# EasyEDA Pro project compute-module-v101.eprj, schematic main-board
Board Name: main-board; Create Date: 2025-09-19; Page Name: P1; Project Name: compute-module-v101; Schematic Name: main-board; Update Date: 2025-12-01; Company: EasyEDA.com; Page Size: A4; Version: V1.0
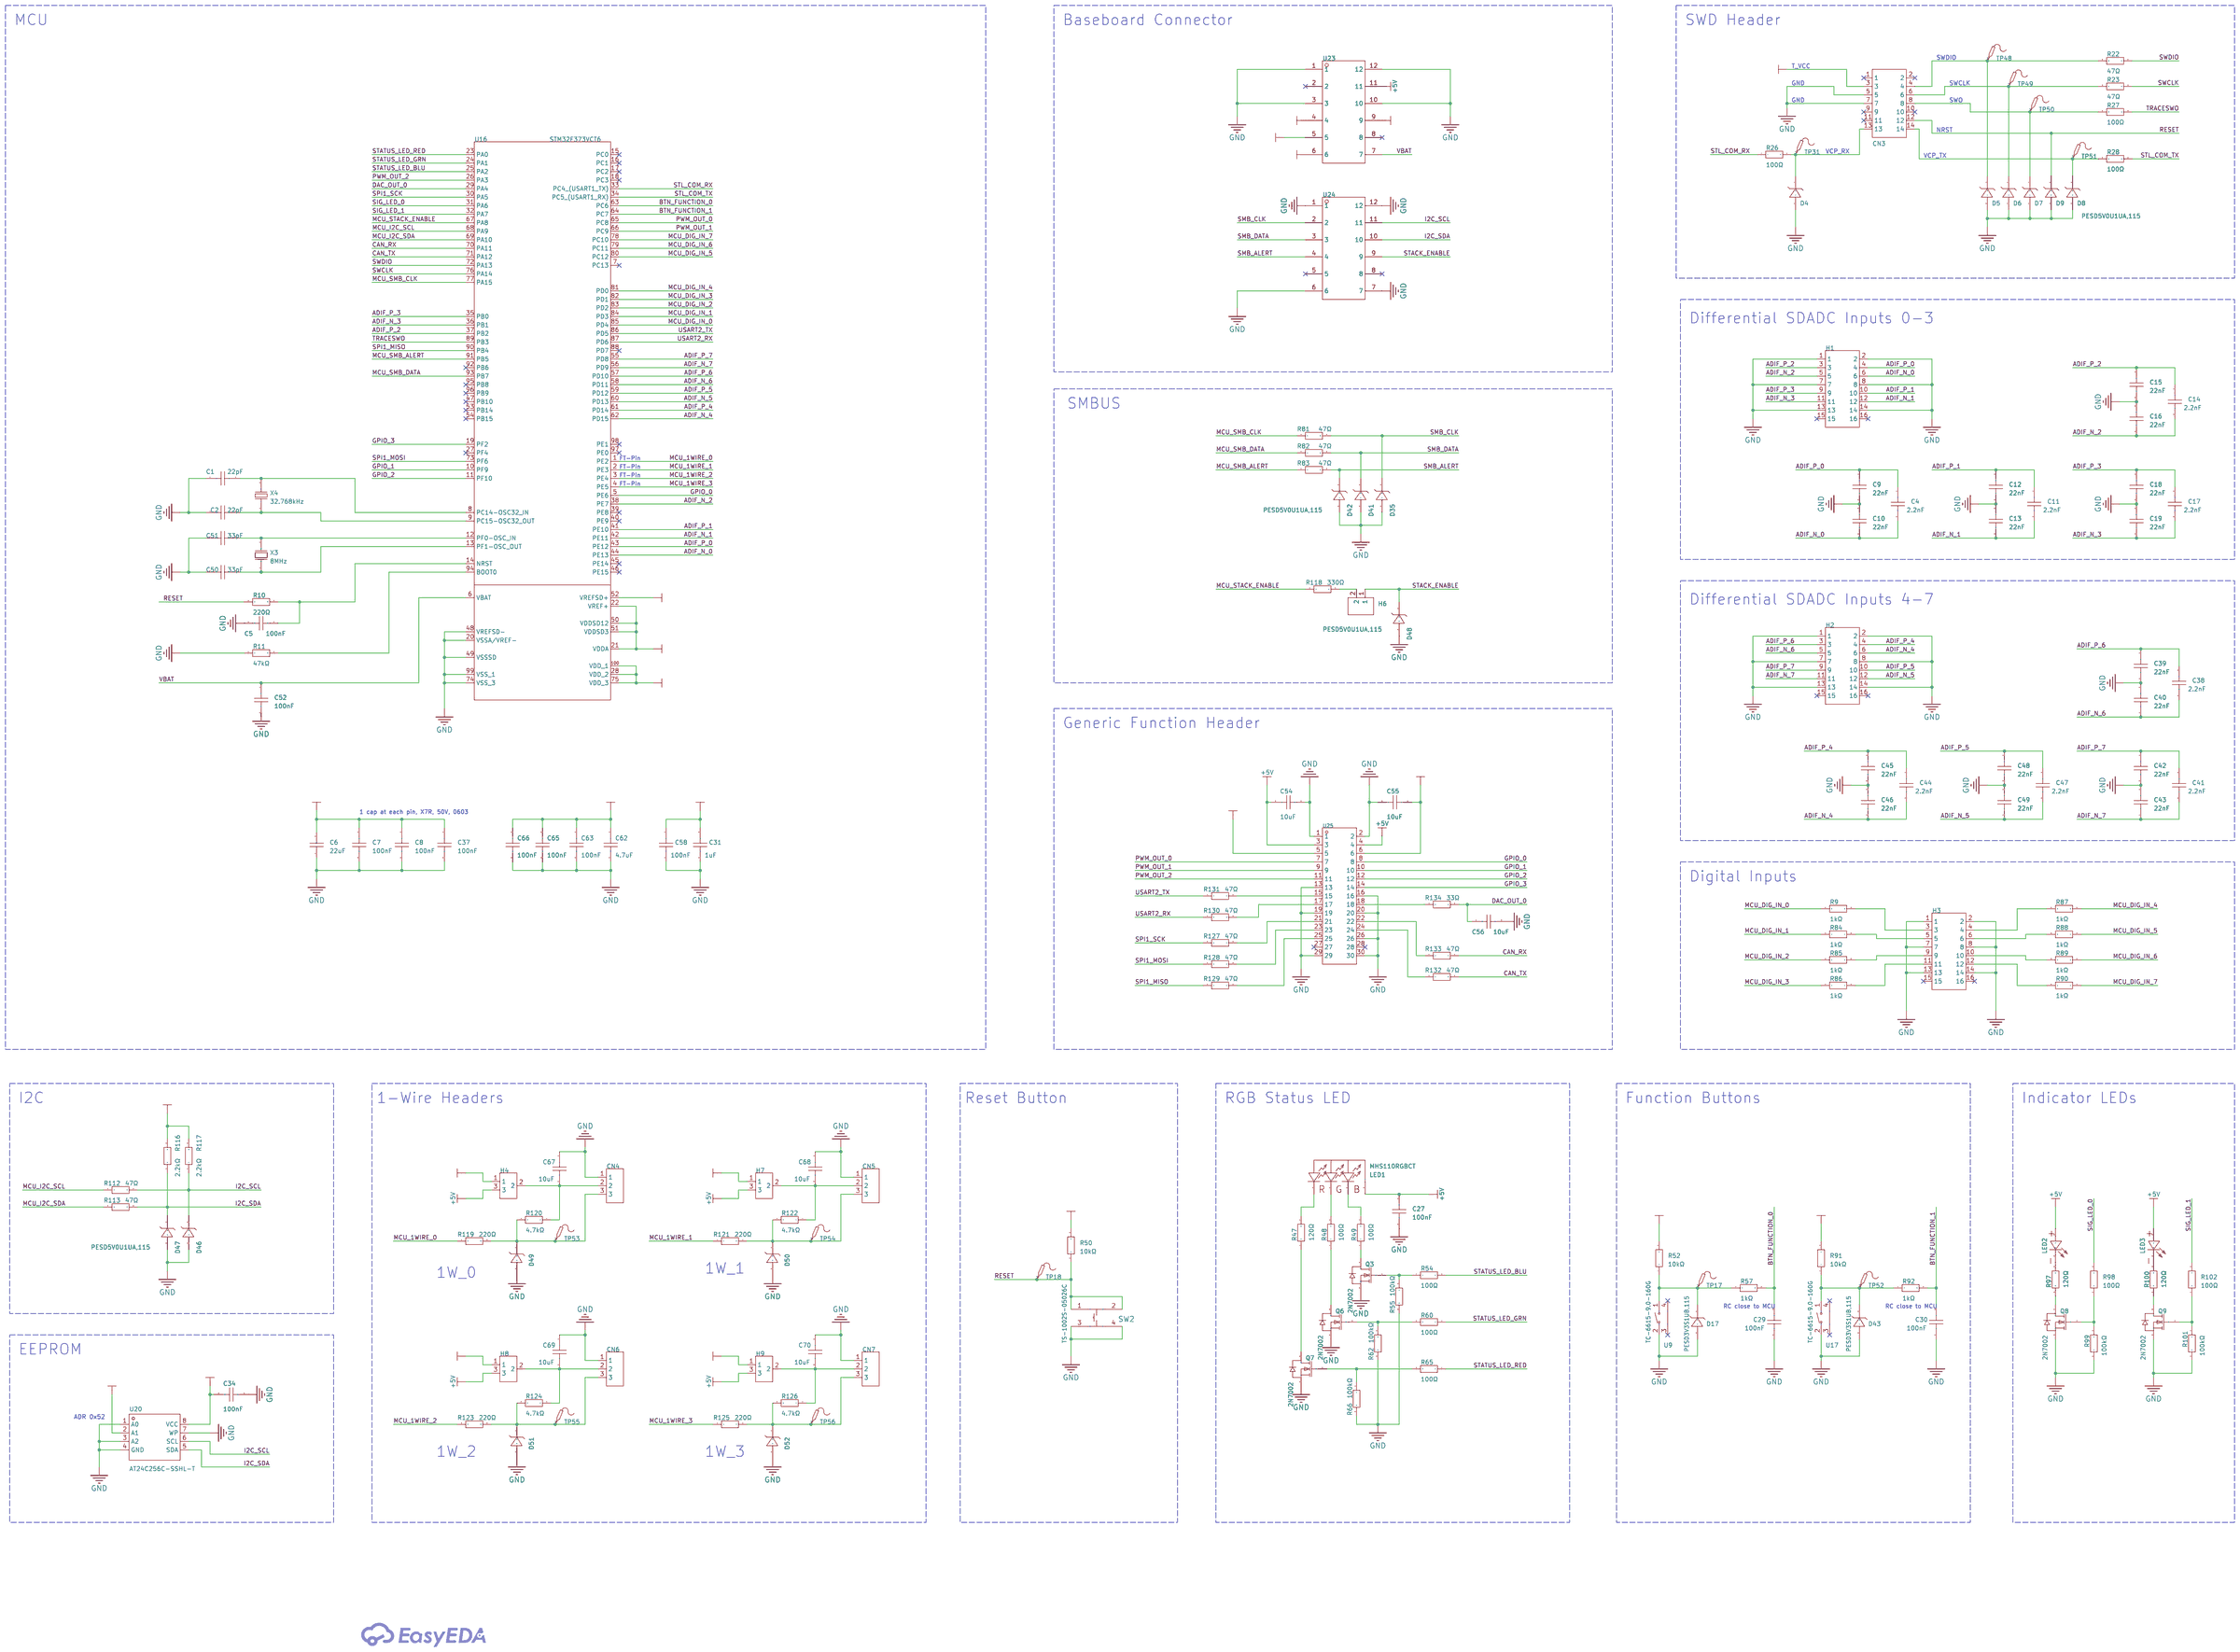
[diagram p1: schematic sheet]

## Parts
C1  22pF  [C0603]
C2  22pF  [C0603]
C4  2.2nF  [C0603]
C5  100nF  [C0603]
C6  22uF  [C0603]
C7  100nF  [C0603]
C8  100nF  [C0603]
C9  22nF  [C0603]
C10  22nF  [C0603]
C11  2.2nF  [C0603]
C12  22nF  [C0603]
C13  22nF  [C0603]
C14  2.2nF  [C0603]
C15  22nF  [C0603]
C16  22nF  [C0603]
C17  2.2nF  [C0603]
C18  22nF  [C0603]
C19  22nF  [C0603]
C27  100nF  [C0603]
C29  100nF  [C0603]
C30  100nF  [C0603]
C31  1uF  [C0603]
C34  100nF  [C0603]
C37  100nF  [C0603]
C38  2.2nF  [C0603]
C39  22nF  [C0603]
C40  22nF  [C0603]
C41  2.2nF  [C0603]
C42  22nF  [C0603]
C43  22nF  [C0603]
C44  2.2nF  [C0603]
C45  22nF  [C0603]
C46  22nF  [C0603]
C47  2.2nF  [C0603]
C48  22nF  [C0603]
C49  22nF  [C0603]
C50  33pF  [C0603]
C51  33pF  [C0603]
C52  100nF  [C0603]
C54  10uF  [C0603]
C55  10uF  [C0603]
C56  10uF  [C0603]
C58  100nF  [C0603]
C62  4.7uF  [C0603]
C63  100nF  [C0603]
C65  100nF  [C0603]
C66  100nF  [C0603]
C67  10uF  [C0603]
C68  10uF  [C0603]
C69  10uF  [C0603]
C70  10uF  [C0603]
CN3  HX PZ1.27-2x7P WZ  [HDR-TH_14P-P1.27-H-M-R2-C7-S1.27-W7.5-N]
CN4  B3B-PH-K-S(LF)(SN)  [CONN-TH_B3B-PH-K-S]
CN5  B3B-PH-K-S(LF)(SN)  [CONN-TH_B3B-PH-K-S]
CN6  B3B-PH-K-S(LF)(SN)  [CONN-TH_B3B-PH-K-S]
CN7  B3B-PH-K-S(LF)(SN)  [CONN-TH_B3B-PH-K-S]
D4  PESD5V0U1UA,115  [SOD-323_L1.8-W1.3-LS2.5-RD]
D5  PESD5V0U1UA,115  [SOD-323_L1.8-W1.3-LS2.5-RD]
D6  PESD5V0U1UA,115  [SOD-323_L1.8-W1.3-LS2.5-RD]
D7  PESD5V0U1UA,115  [SOD-323_L1.8-W1.3-LS2.5-RD]
D8  PESD5V0U1UA,115  [SOD-323_L1.8-W1.3-LS2.5-RD]
D9  PESD5V0U1UA,115  [SOD-323_L1.8-W1.3-LS2.5-RD]
D17  PESD3V3S1UB,115  [SOD-523_L1.2-W0.8-LS1.6-RD]
D35  PESD5V0U1UA,115  [SOD-323_L1.8-W1.3-LS2.5-RD]
D41  PESD5V0U1UA,115  [SOD-323_L1.8-W1.3-LS2.5-RD]
D42  PESD5V0U1UA,115  [SOD-323_L1.8-W1.3-LS2.5-RD]
D43  PESD3V3S1UB,115  [SOD-523_L1.2-W0.8-LS1.6-RD]
D46  PESD5V0U1UA,115  [SOD-323_L1.8-W1.3-LS2.5-RD]
D47  PESD5V0U1UA,115  [SOD-323_L1.8-W1.3-LS2.5-RD]
D48  PESD5V0U1UA,115  [SOD-323_L1.8-W1.3-LS2.5-RD]
D49  PESD5V0U1UA,115  [SOD-323_L1.8-W1.3-LS2.5-RD]
D50  PESD5V0U1UA,115  [SOD-323_L1.8-W1.3-LS2.5-RD]
D51  PESD5V0U1UA,115  [SOD-323_L1.8-W1.3-LS2.5-RD]
D52  PESD5V0U1UA,115  [SOD-323_L1.8-W1.3-LS2.5-RD]
H1  XDZ200-2-08-S-2.0-G1  [HDR-SMD_16P-P2.00-V-M-R2-C8-LS6.5]
H2  XDZ200-2-08-S-2.0-G1  [HDR-SMD_16P-P2.00-V-M-R2-C8-LS6.5]
H3  XDZ200-2-08-S-2.0-G1  [HDR-SMD_16P-P2.00-V-M-R2-C8-LS6.5]
H4  X6511WVS-03H-C60D48R2  [HDR-SMD_3P-P2.54_XKB_X6511WVS-03H-C60D48R2]
H6  PZ254V-11-02P  [HDR-TH_2P-P2.54-V-M]
H7  X6511WVS-03H-C60D48R2  [HDR-SMD_3P-P2.54_XKB_X6511WVS-03H-C60D48R2]
H8  X6511WVS-03H-C60D48R2  [HDR-SMD_3P-P2.54_XKB_X6511WVS-03H-C60D48R2]
H9  X6511WVS-03H-C60D48R2  [HDR-SMD_3P-P2.54_XKB_X6511WVS-03H-C60D48R2]
LED1  MHS110RGBCT  [LED-ARRAY-SMD_MHS110RGBCT]
LED2  LTST-S220TGKT  [LED-SMD_L2.2-W0.6-RD_GREEN]
LED3  LTST-S220TGKT  [LED-SMD_L2.2-W0.6-RD_GREEN]
Q3  2N7002  [SOT-23-3_L2.9-W1.3-P1.90-LS2.4-BR]
Q6  2N7002  [SOT-23-3_L2.9-W1.3-P1.90-LS2.4-BR]
Q7  2N7002  [SOT-23-3_L2.9-W1.3-P1.90-LS2.4-BR]
Q8  2N7002  [SOT-23-3_L2.9-W1.3-P1.90-LS2.4-BR]
Q9  2N7002  [SOT-23-3_L2.9-W1.3-P1.90-LS2.4-BR]
R9  1kΩ  [R0603]
R10  220Ω  [R0603]
R11  47kΩ  [R0603]
R22  47Ω  [R0603]
R23  47Ω  [R0603]
R26  100Ω  [R0603]
R27  100Ω  [R0603]
R28  100Ω  [R0603]
R47  120Ω  [R0603]
R48  100Ω  [R0603]
R49  100Ω  [R0603]
R50  10kΩ  [R0603]
R52  10kΩ  [R0603]
R54  100Ω  [R0603]
R55  100kΩ  [R0603]
R57  1kΩ  [R0603]
R60  100Ω  [R0603]
R62  100kΩ  [R0603]
R65  100Ω  [R0603]
R66  100kΩ  [R0603]
R81  47Ω  [R0603]
R82  47Ω  [R0603]
R83  47Ω  [R0603]
R84  1kΩ  [R0603]
R85  1kΩ  [R0603]
R86  1kΩ  [R0603]
R87  1kΩ  [R0603]
R88  1kΩ  [R0603]
R89  1kΩ  [R0603]
R90  1kΩ  [R0603]
R91  10kΩ  [R0603]
R92  1kΩ  [R0603]
R97  120Ω  [R0603]
R98  100Ω  [R0603]
R99  100kΩ  [R0603]
R100  120Ω  [R0603]
R101  100kΩ  [R0603]
R102  100Ω  [R0603]
R112  47Ω  [R0603]
R113  47Ω  [R0603]
R116  2.2kΩ  [R0603]
R117  2.2kΩ  [R0603]
R118  330Ω  [R0603]
R119  220Ω  [R0603]
R120  4.7kΩ  [R0603]
R121  220Ω  [R0603]
R122  4.7kΩ  [R0603]
R123  220Ω  [R0603]
R124  4.7kΩ  [R0603]
R125  220Ω  [R0603]
R126  4.7kΩ  [R0603]
R127  47Ω  [R0603]
R128  47Ω  [R0603]
R129  47Ω  [R0603]
R130  47Ω  [R0603]
R131  47Ω  [R0603]
R132  47Ω  [R0603]
R133  47Ω  [R0603]
R134  33Ω  [R0603]
SW2  TS-1002S-05026C  [KEY-SMD_4P-L6.0-W6.0-P4.50-LS9.0]
TP17  -  [Test-Point-0.5mm]
TP18  -  [Test-Point-0.5mm]
TP31  -  [Test-Point-0.5mm]
TP48  -  [Test-Point-0.5mm]
TP49  -  [Test-Point-0.5mm]
TP50  -  [Test-Point-0.5mm]
TP51  -  [Test-Point-0.5mm]
TP52  -  [Test-Point-0.5mm]
TP53  -  [Test-Point-0.5mm]
TP54  -  [Test-Point-0.5mm]
TP55  -  [Test-Point-0.5mm]
TP56  -  [Test-Point-0.5mm]
U9  TC-6615-9.0-160G  [KEY-TH_PTS645VXX83XLFS]
U16  STM32F373VCT6  [LQFP-100_L14.0-W14.0-P0.50-LS16.0-BL]
U17  TC-6615-9.0-160G  [KEY-TH_PTS645VXX83XLFS]
U20  AT24C256C-SSHL-T  [SOIC-8_L4.9-W3.9-P1.27-LS6.0-BL]
U23  -  [ED12BGFBK-CARD]  (no BOM)
U24  -  [ED12BGFBK-CARD]  (no BOM)
U25  XDZ200-2-15-S-2.0-G1  [HDR-SMD_30P-P2.00-V-M-R2-C15-LS6.5]
X3  8MHz  [CRYSTAL-SMD_L5.0-W3.2]
X4  32.768kHz  [FC-135R_L3.2-W1.5]

## Library data of the parts
C1 C2 = CL10C220JB8NNNC: Capacitance:22pF Tolerance:±5% Tolerance:±5% Voltage Rating:50V Temperature Coefficient:C0G; LCSC Part Name: 22pF ±5% 50V; Supplier Part: C1653; Manufacturer: SAMSUNG(三星); Supplier Footprint: 0603; JLCPCB Part Class: Basic Part; Datasheet: https://item.szlcsc.com/datasheet/CL10C220JB8NNNC/2005.html; Supplier: LCSC; Tolerance: ±5%; Voltage Rating: 50V; Temperature Coefficient: C0G
C4 C11 C14 C17 C38 C41 C44 C47 = 0603B222K500NT: Capacitance:2.2nF Tolerance:±10% Tolerance:±10% Voltage Rating:50V Temperature Coefficient:X7R; LCSC Part Name: 2.2nF ±10% 50V; Supplier Part: C1604; Manufacturer: FH(风华); Supplier Footprint: 0603; JLCPCB Part Class: Basic Part; Datasheet: https://item.szlcsc.com/datasheet/0603B222K500NT/1956.html; Supplier: LCSC; Tolerance: ±10%; Voltage Rating: 50V; Temperature Coefficient: X7R
C5 C7 C8 C27 C29 C30 C34 C37 C52 C58 C63 C65 C66 = CC0603KRX7R9BB104: Capacitance:100nF Tolerance:±10% Tolerance:±10% Voltage Rating:50V Temperature Coefficient:X7R; LCSC Part Name: 100nF ±10% 50V; Supplier Part: C14663; Manufacturer: YAGEO(国巨); Supplier Footprint: 0603; JLCPCB Part Class: Basic Part; Datasheet: https://item.szlcsc.com/datasheet/CC0603KRX7R9BB104/15331.html; Supplier: LCSC; Tolerance: ±10%; Voltage Rating: 50V; Temperature Coefficient: X7R
C6 = CL10A226MQ8NRNC: Capacitance:22uF Tolerance:±20% Tolerance:±20% Voltage Rating:6.3V Temperature Coefficient:X5R; LCSC Part Name: 22uF ±20% 6.3V; Supplier Part: C59461; Manufacturer: SAMSUNG(三星); Supplier Footprint: 0603; JLCPCB Part Class: Basic Part; Datasheet: https://item.szlcsc.com/datasheet/CL10A226MQ8NRNC/60514.html; Supplier: LCSC; Tolerance: ±20%; Voltage Rating: 6.3V; Temperature Coefficient: X5R
C9 C10 C12 C13 C15 C16 C18 C19 C39 C40 C42 C43 C45 C46 C48 C49 = CL10B223KB8NNNC: Capacitance:22nF Tolerance:±10% Tolerance:±10% Voltage Rating:50V Temperature Coefficient:X7R; LCSC Part Name: 22nF ±10% 50V; Supplier Part: C21122; Manufacturer: SAMSUNG(三星); Supplier Footprint: 0603; JLCPCB Part Class: Basic Part; Datasheet: https://item.szlcsc.com/datasheet/CL10B223KB8NNNC/21834.html; Supplier: LCSC; Tolerance: ±10%; Voltage Rating: 50V; Temperature Coefficient: X7R
C31 = CL10A105KB8NNNC: Capacitance:1uF Tolerance:±10% Tolerance:±10% Voltage Rating:50V Temperature Coefficient:X5R; LCSC Part Name: 1uF ±10% 50V; Supplier Part: C15849; Manufacturer: SAMSUNG(三星); Supplier Footprint: 0603; JLCPCB Part Class: Basic Part; Datasheet: https://item.szlcsc.com/datasheet/CL10A105KB8NNNC/16531.html; Supplier: LCSC; Tolerance: ±10%; Voltage Rating: 50V; Temperature Coefficient: X5R
C50 C51 = CL10C330JB8NNNC: Capacitance:33pF Tolerance:±5% Tolerance:±5% Voltage Rating:50V Temperature Coefficient:C0G; LCSC Part Name: 33pF ±5% 50V; Supplier Part: C1663; Manufacturer: SAMSUNG(三星); Supplier Footprint: 0603; JLCPCB Part Class: Basic Part; Datasheet: https://item.szlcsc.com/datasheet/CL10C330JB8NNNC/2015.html; Supplier: LCSC; Tolerance: ±5%; Voltage Rating: 50V; Temperature Coefficient: C0G
C54-C56 C67-C70 = CL10A106MA8NRNC: Capacitance:10uF Tolerance:±20% Tolerance:±20% Voltage Rating:25V Temperature Coefficient:X5R; LCSC Part Name: 10uF ±20% 25V; Supplier Part: C96446; Manufacturer: SAMSUNG(三星); Supplier Footprint: 0603; JLCPCB Part Class: Basic Part; Datasheet: https://item.szlcsc.com/datasheet/CL10A106MA8NRNC/97651.html; Supplier: LCSC; Tolerance: ±20%; Voltage Rating: 25V; Temperature Coefficient: X5R
C62 = CL10A475KO8NNNC: Capacitance:4.7uF Tolerance:±10% Tolerance:±10% Voltage Rating:16V Temperature Coefficient:X5R; LCSC Part Name: 4.7uF ±10% 16V; Supplier Part: C19666; Manufacturer: SAMSUNG(三星); Supplier Footprint: 0603; JLCPCB Part Class: Basic Part; Datasheet: https://item.szlcsc.com/datasheet/CL10A475KO8NNNC/20375.html; Supplier: LCSC; Tolerance: ±10%; Voltage Rating: 16V; Temperature Coefficient: X5R
CN3 = HX PZ1.27-2x7P WZ: Pin Structure:2x7P Pitch:1.27mm Row Spacing:1.27mm Circluar Pins/Square Pins:Pin Header Mounting Type:Right Angle Number of Rows:2 Number of Pins:14P Current Rating:1A Voltage Rating (Max):500V Length of Mating Pin:4mm Insulation Height:1mm Length of End; LCSC Part Name: 2x7P 间距:1.27mm 方针 弯插; Supplier Part: C22438113; Manufacturer: hanxia(韩下); Supplier Footprint: 弯插,P=1.27mm; JLCPCB Part Class: Extended Part; Datasheet: https://item.szlcsc.com/datasheet/HX%2520PZ1.27-2x7P%2520WZ/24075358.html; Supplier: LCSC; Pin Structure: 2x7P; Pitch: 1.27mm; Row Spacing: 1.27mm; Circluar Pins/Square Pins: Pin Header; Mounting Type: Right Angle; Number of Rows: 2; Number of Pins: 14P; Current Rating: 1A; Voltage Rating (Max): 500V; Length of Mating Pin: 4mm; Insulation Height: 1mm; Contact Material: Brass; Contact Plating: Gold; Operating Temperature: -40℃~+105℃; Color: Black
CN4-CN7 = B3B-PH-K-S(LF)(SN): LCSC Part Name: 1x3P 间距:2mm 直插 系列:PH; Supplier Part: C131339; Manufacturer: JST; Supplier Footprint: 插件,P=2mm; JLCPCB Part Class: Extended Part; Datasheet: https://item.szlcsc.com/datasheet/B3B-PH-K-S(LF)(SN)/142632.html; Supplier: LCSC; Pins Structure: 1x3P; Pitch: 2mm; Mounting Type: Through Hole; Reference Series: PH; Number of Pins: 3P; Number of Rows: 1; Number of PINs Per Row: 3; Current Rating: 2A; Contact Material: Brass; Contact Plating: Tin; Operating Temperature: -25℃~+85℃; Voltage Rating: 100V; Plastic Material: PA66; Flame Retardant Rating: UL94V-0; Supplementary Features: K Pin; Color: White; Z-Height of the Board: 6mm; X-Length of Bottom Edge on Board (Spacing Line): 7.9mm; Y-Width of Bottom Edge on Board: 4.5mm
D4-D9 D35 D41 D42 D46-D52 = PESD5V0U1UA,115: LCSC Part Name: 单向ESD; Supplier Part: C139614; Manufacturer: Nexperia(安世); Supplier Footprint: SOD-323; JLCPCB Part Class: Extended Part; Datasheet: https://item.szlcsc.com/datasheet/PESD5V0U1UA%252C115/150939.html; Supplier: LCSC; Polarity: Unidirectional; Reverse Stand-Off Voltage (Vrwm): 5V; Clamping Voltage: 11V; Peak Pulse Current (Ipp): 1.3A@8/20us; Voltage - Breakdown: 8.8V; Reverse Leakage Current (Ir): 1nA; Number of Channels: 1; Operating Temperature: -55℃~+150℃@(Ta); level of protection: IEC 61000-4-2; Type: ESD; Junction Capacitance: 2pF
D17 D43 = PESD3V3S1UB,115: LCSC Part Name: 单向ESD; Supplier Part: C85377; Manufacturer: Nexperia(安世); Supplier Footprint: SC-79(SOD-523); JLCPCB Part Class: Extended Part; Datasheet: https://item.szlcsc.com/datasheet/PESD3V3S1UB%252C115/86550.html; Supplier: LCSC; Polarity: Unidirectional; Reverse Stand-Off Voltage (Vrwm): 3.3V; Clamping Voltage: 20V; Peak Pulse Current (Ipp): 18A; Peak Pulse Power Dissipation (Ppp): 330W; Voltage - Breakdown: 5.2V; Number of Channels: 1; Operating Temperature: -65℃~+150℃@(Ta); Type: ESD
H1-H3 = XDZ200-2-08-S-2.0-G1: LCSC Part Name: 2x8P 间距:2mm 方针 立贴; Supplier Part: C19268811; Manufacturer: XUNDA(讯答); Supplier Footprint: SMD,P=2mm; JLCPCB Part Class: Extended Part; Datasheet: https://item.szlcsc.com/datasheet/XDZ200-2-08-S-2.0-G1/20528703.html; Supplier: LCSC; Pin Structure: 2x8P; Pitch: 2mm; Circluar Pins/Square Pins: Pin Header; Mounting Type: Surface Mount,Vertical; Number of Rows: 2; Number of Pins: 16P; Current Rating: 1.5A; Length of Mating Pin: 4mm; Insulation Height: 2mm; Operating Temperature: -40℃~+105℃; Color: Black
H4 H7-H9 = X6511WVS-03H-C60D48R2: Pin Structure:1x3P Pitch:2.54mm Row Spacing:2.54mm Circluar Pins/Square Pins:Policy Number of Rows:Single Row Number of Pins:3P Current Rating:3A Voltage Rating (Max):250V Length of Mating Pin:- Insulation Height:2.5mm Length of End Connection Pin:- Conta; LCSC Part Name: 1x3P 间距:2.54mm 方针; Supplier Part: C2883760; Manufacturer: XKB Connection(中国星坤); Supplier Footprint: SMD,P=2.54mm; JLCPCB Part Class: Extended Part; Datasheet: https://atta.szlcsc.com/upload/public/pdf/source/20200909/C780060_F941EB1B69F43B5D6329EAF74E2E27BB.pdf; Supplier: LCSC; Pin Structure: 1x3P; Pitch: 2.54mm; Row Spacing: 2.54mm; Circluar Pins/Square Pins: Policy; Number of Rows: Single Row; Number of Pins: 3P; Current Rating: 3A; Voltage Rating (Max): 250V; Insulation Height: 2.5mm; Contact Material: Brass; Contact Plating: Gold; Operating Temperature: -40℃~+105℃; Color: Black
H6 = PZ254V-11-02P: LCSC Part Name: 1x2P 间距:2.54mm 方针 直插; Supplier Part: C492401; Manufacturer: XFCN(兴飞); Supplier Footprint: 插件,P=2.54mm; JLCPCB Part Class: Extended Part; Datasheet: https://item.szlcsc.com/datasheet/PZ254V-11-02P/502957.html; Supplier: LCSC; Pin Structure: 1x2P; Pitch: 2.54mm; Circluar Pins/Square Pins: Pin Header; Mounting Type: Through Hole; Number of Rows: 1; Number of Pins: 2P; Length of Mating Pin: 6mm; Insulation Height: 2.5mm; Length of End Connection Pin: 3mm; Contact Material: Brass; Operating Temperature: -40℃~+105℃; Color: Black
LED1 = MHS110RGBCT: LCSC Part Name: RGB三色 侧贴; Supplier Part: C389528; Manufacturer: MEIHUA(美华); Supplier Footprint: SMD,1.5x3mm; JLCPCB Part Class: Extended Part; Datasheet: https://atta.szlcsc.com/upload/public/pdf/source/20190530/C389528_18CC971B89683121AF99AD38EE2CA1FC.pdf; Supplier: LCSC
LED2 LED3 = LTST-S220TGKT: Illumination Color:Yellow Green Voltage - Forward(Vf):3.2V Voltage - Forward(Vf):3.2V Power(Watts):76mW Forward Current:20mA Wavelength - Dominant:525nm Wavelength - Dominant:525nm Peak Wavelength:530nm Diode Configuration:- Lens Color:Water Clear Color T; LCSC Part Name: 普绿/黄绿 侧贴; Supplier Part: C160470; Manufacturer: LITEON(光宝); Supplier Footprint: SMD,1x2.2mm; JLCPCB Part Class: Extended Part; Datasheet: https://item.szlcsc.com/datasheet/LTST-S220TGKT/171850.html; Supplier: LCSC; Illumination Color: Yellow Green; Voltage - Forward(Vf): 3.2V; Power(Watts): 76mW; Forward Current: 20mA; Wavelength - Dominant: 525nm; Peak Wavelength: 530nm; Lens Color: Water Clear; Luminous Intensity: 260.5mcd; Viewing Angle: 130°; Mounting Style: Side View Mount; Operating Temperature: -20℃~+80℃
Q3 Q6-Q9 = 2N7002_C8545: LCSC Part Name: 1个N沟道 耐压:60V 电流:115mA; Supplier Part: C8545; Manufacturer: CJ(江苏长电/长晶); Supplier Footprint: SOT-23; JLCPCB Part Class: Basic Part; Datasheet: https://item.szlcsc.com/datasheet/2N7002/9040.html; Supplier: LCSC; Number: 1 N-Channel; Drain to Source Voltage: 60V; Current - Continuous Drain(Id): 115mA; RDS(on): 5Ω@10V; Pd - Power Dissipation: 225mW; Gate Threshold Voltage (Vgs(th)): 2.5V; Input Capacitance(Ciss): 50pF; Reverse Transfer Capacitance (Crss@Vds): 5pF
R9 R57 R84-R90 R92 = 0603WAF1001T5E: Type:Thick Film Resistors Resistance:1kΩ Tolerance:±1% Tolerance:±1% Power(Watts): Overload Voltage (Max): Temperature Coefficient:±100ppm/℃ Temperature Coefficient:±100ppm/℃ Operating Temperature Range:-55℃~+155℃ Operating Temperature Range:-55℃~+155℃; LCSC Part Name: 1kΩ ±1% 100mW 厚膜电阻; Supplier Part: C21190; Manufacturer: UNI-ROYAL(厚声); Supplier Footprint: 0603; JLCPCB Part Class: Basic Part; Datasheet: https://atta.szlcsc.com/upload/public/pdf/source/20200306/C422600_1E6D84923E4A46A82E41ADD87F860B5C.pdf; Supplier: LCSC; Type: Thick Film Resistors; Tolerance: ±1%; Temperature Coefficient: ±100ppm/℃; Operating Temperature Range: -55℃~+155℃
R10 R119 R121 R123 R125 = 0603WAF2200T5E: Type:Thick Film Resistors Resistance: Tolerance:±1% Tolerance:±1% Power(Watts): Overload Voltage (Max): Temperature Coefficient:±100ppm/℃ Temperature Coefficient:±100ppm/℃ Operating Temperature Range:-55℃~+155℃ Operating Temperature Range:-55℃~+155℃; LCSC Part Name: 220Ω ±1% 100mW 厚膜电阻; Supplier Part: C22962; Manufacturer: UNI-ROYAL(厚声); Supplier Footprint: 0603; JLCPCB Part Class: Basic Part; Datasheet: https://atta.szlcsc.com/upload/public/pdf/source/20200306/C422600_1E6D84923E4A46A82E41ADD87F860B5C.pdf; Supplier: LCSC; Type: Thick Film Resistors; Tolerance: ±1%; Temperature Coefficient: ±100ppm/℃; Operating Temperature Range: -55℃~+155℃
R11 = 0603WAF4702T5E: Type:Thick Film Resistor Resistance:47kΩ Tolerance:±1% Tolerance:±1% Power(Watts):100mW Voltage-Supply(Max):75V Temperature Coefficient:±100ppm/℃ Temperature Coefficient:±100ppm/℃ Operating Temperature:-55℃~+155℃ Operating Temperature:-55℃~+155℃; LCSC Part Name: 47kΩ ±1% 100mW 厚膜电阻; Supplier Part: C25819; Manufacturer: UNI-ROYAL(厚声); Supplier Footprint: 0603; JLCPCB Part Class: Basic Part; Datasheet: https://item.szlcsc.com/datasheet/0603WAF4702T5E/26562.html; Supplier: LCSC; Type: Thick Film Resistor; Tolerance: ±1%; Power(Watts): 100mW; Voltage-Supply(Max): 75V; Temperature Coefficient: ±100ppm/℃; Operating Temperature: -55℃~+155℃
R22 R23 R81-R83 R112 R113 R127-R133 = 0603WAF470JT5E: Type:Thick Film Resistor Resistance:47Ω Tolerance:±1% Tolerance:±1% Power(Watts):100mW Voltage-Supply(Max):75V Temperature Coefficient:±100ppm/℃ Temperature Coefficient:±100ppm/℃ Operating Temperature:-55℃~+155℃ Operating Temperature:-55℃~+155℃; LCSC Part Name: 47Ω ±1% 100mW 厚膜电阻; Supplier Part: C23182; Manufacturer: UNI-ROYAL(厚声); Supplier Footprint: 0603; JLCPCB Part Class: Basic Part; Datasheet: https://item.szlcsc.com/datasheet/0603WAF470JT5E/23909.html; Supplier: LCSC; Type: Thick Film Resistor; Tolerance: ±1%; Power(Watts): 100mW; Voltage-Supply(Max): 75V; Temperature Coefficient: ±100ppm/℃; Operating Temperature: -55℃~+155℃
R26-R28 R48 R49 R54 R60 R65 R98 R102 = 0603WAF1000T5E: Type:Thick Film Resistors Resistance: Tolerance:±1% Tolerance:±1% Power(Watts): Overload Voltage (Max): Temperature Coefficient:±200ppm/℃ Temperature Coefficient:±200ppm/℃ Operating Temperature Range:-55℃~+155℃ Operating Temperature Range:-55℃~+155℃; LCSC Part Name: 100Ω ±1% 100mW 厚膜电阻; Supplier Part: C22775; Manufacturer: UNI-ROYAL(厚声); Supplier Footprint: 0603; JLCPCB Part Class: Basic Part; Datasheet: https://atta.szlcsc.com/upload/public/pdf/source/20200306/C422600_1E6D84923E4A46A82E41ADD87F860B5C.pdf; Supplier: LCSC; Type: Thick Film Resistors; Tolerance: ±1%; Temperature Coefficient: ±200ppm/℃; Operating Temperature Range: -55℃~+155℃
R47 = 0603WAF1200T5E: Type:Thick Film Resistors Resistance: Tolerance:±1% Tolerance:±1% Power(Watts): Overload Voltage (Max): Temperature Coefficient:±100ppm/℃ Temperature Coefficient:±100ppm/℃ Operating Temperature Range:-55℃~+155℃ Operating Temperature Range:-55℃~+155℃; LCSC Part Name: 120Ω ±1% 100mW 厚膜电阻; Supplier Part: C22787; Manufacturer: UNI-ROYAL(厚声); Supplier Footprint: 0603; JLCPCB Part Class: Basic Part; Datasheet: https://atta.szlcsc.com/upload/public/pdf/source/20200306/C422600_1E6D84923E4A46A82E41ADD87F860B5C.pdf; Supplier: LCSC; Type: Thick Film Resistors; Tolerance: ±1%; Temperature Coefficient: ±100ppm/℃; Operating Temperature Range: -55℃~+155℃
R50 R52 R91 = 0603WAF1002T5E: Type:Thick Film Resistor Resistance:10kΩ Tolerance:±1% Tolerance:±1% Power(Watts):100mW Voltage-Supply(Max):75V Temperature Coefficient:±100ppm/℃ Temperature Coefficient:±100ppm/℃ Operating Temperature:-55℃~+155℃ Operating Temperature:-55℃~+155℃; LCSC Part Name: 厚膜电阻 10kΩ ±1% 100mW; Supplier Part: C25804; Manufacturer: UNI-ROYAL(厚声); Supplier Footprint: 0603; JLCPCB Part Class: Basic Part; Datasheet: https://item.szlcsc.com/datasheet/0603WAF1002T5E/26547.html; Supplier: LCSC; Type: Thick Film Resistor; Tolerance: ±1%; Power(Watts): 100mW; Voltage-Supply(Max): 75V; Temperature Coefficient: ±100ppm/℃; Operating Temperature: -55℃~+155℃
R55 R62 R66 R99 R101 = 0603WAF1003T5E: Type:Thick Film Resistor Resistance:100kΩ Tolerance:±1% Tolerance:±1% Power(Watts):100mW Voltage-Supply(Max):75V Temperature Coefficient:±100ppm/℃ Temperature Coefficient:±100ppm/℃ Operating Temperature:-55℃~+155℃ Operating Temperature:-55℃~+155℃; LCSC Part Name: 100kΩ ±1% 100mW 厚膜电阻; Supplier Part: C25803; Manufacturer: UNI-ROYAL(厚声); Supplier Footprint: 0603; JLCPCB Part Class: Basic Part; Datasheet: https://item.szlcsc.com/datasheet/0603WAF1003T5E/26546.html; Supplier: LCSC; Type: Thick Film Resistor; Tolerance: ±1%; Power(Watts): 100mW; Voltage-Supply(Max): 75V; Temperature Coefficient: ±100ppm/℃; Operating Temperature: -55℃~+155℃
R97 R100 = 0603WAF1200T5E: Type:Thick Film Resistor Resistance:120Ω Tolerance:±1% Tolerance:±1% Power(Watts):100mW Voltage-Supply(Max):75V Temperature Coefficient:±100ppm/℃ Temperature Coefficient:±100ppm/℃ Operating Temperature:-55℃~+155℃ Operating Temperature:-55℃~+155℃; LCSC Part Name: 120Ω ±1% 100mW 厚膜电阻; Supplier Part: C22787; Manufacturer: UNI-ROYAL(厚声); Supplier Footprint: 0603; JLCPCB Part Class: Basic Part; Datasheet: https://item.szlcsc.com/datasheet/0603WAF1200T5E/23514.html; Supplier: LCSC; Type: Thick Film Resistor; Tolerance: ±1%; Power(Watts): 100mW; Temperature Coefficient: ±100ppm/℃; Operating Temperature Range: -55℃~+155℃; Voltage-Supply(Max): 75V; Operating Temperature: -55℃~+155℃
R116 R117 = 0603WAF2201T5E_C4190: Type:Thick Film Resistors Resistance:2.2kΩ Tolerance:±1% Tolerance:±1% Power(Watts): Overload Voltage (Max): Temperature Coefficient:±100ppm/℃ Temperature Coefficient:±100ppm/℃ Operating Temperature Range:-55℃~+155℃ Operating Temperature Range:-55℃~+155℃; LCSC Part Name: 2.2kΩ ±1% 100mW 厚膜电阻; Supplier Part: C4190; Manufacturer: UNI-ROYAL(厚声); Manufacturer Part: 0603WAF2201T5E; Supplier Footprint: 0603; JLCPCB Part Class: Basic Part; Datasheet: https://atta.szlcsc.com/upload/public/pdf/source/20200306/C422600_1E6D84923E4A46A82E41ADD87F860B5C.pdf; Supplier: LCSC; Type: Thick Film Resistors; Tolerance: ±1%; Temperature Coefficient: ±100ppm/℃; Operating Temperature Range: -55℃~+155℃
R118 = 0603WAF3300T5E: Type:Thick Film Resistors Resistance: Tolerance:±1% Tolerance:±1% Power(Watts): Overload Voltage (Max): Temperature Coefficient:±100ppm/℃ Temperature Coefficient:±100ppm/℃ Operating Temperature Range:-55℃~+155℃ Operating Temperature Range:-55℃~+155℃; LCSC Part Name: 330Ω ±1% 100mW 厚膜电阻; Supplier Part: C23138; Manufacturer: UNI-ROYAL(厚声); Supplier Footprint: 0603; JLCPCB Part Class: Basic Part; Datasheet: https://atta.szlcsc.com/upload/public/pdf/source/20200306/C422600_1E6D84923E4A46A82E41ADD87F860B5C.pdf; Supplier: LCSC; Type: Thick Film Resistors; Tolerance: ±1%; Temperature Coefficient: ±100ppm/℃; Operating Temperature Range: -55℃~+155℃
R120 R122 R124 R126 = 0603WAF4701T5E: Type:Thick Film Resistor Resistance:4.7kΩ Tolerance:±1% Tolerance:±1% Power(Watts):100mW Voltage-Supply(Max):75V Temperature Coefficient:±100ppm/℃ Temperature Coefficient:±100ppm/℃ Operating Temperature:-55℃~+155℃ Operating Temperature:-55℃~+155℃; LCSC Part Name: 4.7kΩ ±1% 100mW 厚膜电阻; Supplier Part: C23162; Manufacturer: UNI-ROYAL(厚声); Supplier Footprint: 0603; JLCPCB Part Class: Basic Part; Datasheet: https://item.szlcsc.com/datasheet/0603WAF4701T5E/23889.html; Supplier: LCSC; Type: Thick Film Resistor; Tolerance: ±1%; Power(Watts): 100mW; Voltage-Supply(Max): 75V; Temperature Coefficient: ±100ppm/℃; Operating Temperature: -55℃~+155℃
R134 = 0603WAF330JT5E: Type:Thick Film Resistor Resistance:33Ω Tolerance:±1% Tolerance:±1% Power(Watts):100mW Voltage-Supply(Max):75V Temperature Coefficient:±100ppm/℃ Temperature Coefficient:±100ppm/℃ Operating Temperature:-55℃~+155℃ Operating Temperature:-55℃~+155℃; LCSC Part Name: 33Ω ±1% 100mW 厚膜电阻; Supplier Part: C23140; Manufacturer: UNI-ROYAL(厚声); Supplier Footprint: 0603; JLCPCB Part Class: Basic Part; Datasheet: https://item.szlcsc.com/datasheet/0603WAF330JT5E/23867.html; Supplier: LCSC; Type: Thick Film Resistor; Tolerance: ±1%; Power(Watts): 100mW; Voltage-Supply(Max): 75V; Temperature Coefficient: ±100ppm/℃; Operating Temperature: -55℃~+155℃
SW2 = TS-1002S-05026C: LCSC Part Name: 6*6*5mm 立贴 轻触开关; Supplier Part: C455110; Manufacturer: XUNPU(讯普); Supplier Footprint: SMD,6x6mm; JLCPCB Part Class: Extended Part; Datasheet: https://atta.szlcsc.com/upload/public/pdf/source/20250513/F8F0C18C3D0EDC07DAC80A3CC3CDA783.pdf; Supplier: LCSC; Circuit: SPST; Actuator Style: Round Button; Mounting Type: Vertical welding; Length: 6mm; Width: 6mm; Switch Height: 5mm; Contact Current: 50mA; Voltage Rating: 12V
TP17 TP18 TP31 TP48-TP56 = Test-Point
U9 U17 = TC-6615-9.0-160G: LCSC Part Name: 6*6*9mm 卧插 轻触开关; Supplier Part: C6575016; Manufacturer: HCTL(华灿天禄); Supplier Footprint: 插件; JLCPCB Part Class: Extended Part; Datasheet: https://atta.szlcsc.com/upload/public/pdf/source/20230523/20C79B748B4ACB531A66068A8A6BD305.pdf; Supplier: LCSC; Circuit: SPST; Actuator Style: Round Button; Operating Force: 160gf; Mounting Style: Horizontal Plug; Switch Length: 6mm; Switch Width: 6mm; Switch Height: 9mm; Strike Gundam: With bracket; Contact Current: 50mA; Voltage Rating (DC): 12V; Insulation Resistance: 100MΩ; Actuator/Cap Color: Black; With Lamp: None; Mechanical Life: 100000 Times; Operating Temperature: -25℃~+85℃
U16 = STM32F373VCT6_C1121903: CPU Core:ARM-M4 CPU Maximum Speed:72MHz Program Storage Size:256KB Number of I/O:84 ADC (Bit):16bit；12bit DAC (Bit):12bit Voltage - Supply:2V~3.6V Voltage - Supply:2V~3.6V Applications:-; LCSC Part Name: 带DSP和FPU的主流混合信号ARM Cortex-M4 MCU，具有256 KB Flash、72 MHz CPU、MPU、16位ADC和比较器; Supplier Part: C1121903; Manufacturer: ST(意法半导体); Supplier Footprint: LQFP-100(14x14); JLCPCB Part Class: Extended Part; Datasheet: https://item.szlcsc.com/datasheet/STM32F373VCT6/1212387.html; Supplier: LCSC; CPU Core: ARM-M4; CPU Maximum Speed: 72MHz; Program Storage Size: 256KB; Number of I/O: 84; ADC (Bit): 16bit；12bit; DAC (Bit): 12bit; Voltage - Supply: 2V~3.6V
U20 = AT24C256C-SSHL-T: Supplier Part: C6482; Manufacturer: MICROCHIP(美国微芯); Supplier Footprint: SOIC-8; JLCPCB Part Class: Extended Part; Datasheet: https://atta.szlcsc.com/upload/public/pdf/source/20140704/1457707098744.pdf; Supplier: LCSC; Interface Type: I2C; Memory Size: 256Kbit; Supply Voltage: 1.7V~5.5V; Operating Temperature: -40℃~+85℃
U23 U24 = ED12BGFBK-CARD
U25 = XDZ200-2-15-S-2.0-G1: LCSC Part Name: 2x15P 间距:2mm 方针 立贴; Supplier Part: C19268818; Manufacturer: XUNDA(讯答); Supplier Footprint: SMD,P=2mm; Datasheet: https://item.szlcsc.com/datasheet/XDZ200-2-15-S-2.0-G1/20528710.html; Supplier: LCSC; Pin Structure: 2x15P; Pitch: 2mm; Circluar Pins/Square Pins: Pin Header; Mounting Type: Surface Mount,Vertical; Number of Rows: 2; Number of Pins: 30P; Current Rating: 1.5A; Length of Mating Pin: 4mm; Insulation Height: 2mm; Operating Temperature: -40℃~+105℃; Color: Black
X3 = X50328MSB2GI: LCSC Part Name: YSX530GA 8MHZ 2P 5032 20PF ±10PPM -40~85℃ (±20PPM); Supplier Part: C115962; Manufacturer: YXC(扬兴晶振); Supplier Footprint: SMD5032-2P; JLCPCB Part Class: Basic Part; Datasheet: https://item.szlcsc.com/datasheet/X50328MSB2GI/117214.html; Supplier: LCSC; Type: Crystal Oscillator; Normal temperature Frequency Tolerance: ±10ppm; Load Capacitance: 20pF; Frequency Stability: ±20ppm; Operating Temperature: -40℃~+85℃
X4 = Q13FC13500004_C32346: LCSC Part Name: 32.768kHz ±20ppm 12.5pF; Supplier Part: C32346; Manufacturer: EPSON(爱普生); Manufacturer Part: Q13FC13500004; Supplier Footprint: SMD3215-2P; JLCPCB Part Class: Basic Part; Datasheet: https://atta.szlcsc.com/upload/public/pdf/source/20240418/0E0FF5F0356BA3753F616001439D1416.pdf; Supplier: LCSC; Crystal Type: Surface Mount Crystal; Normal temperature Frequency Tolerance: ±20ppm; Equivalent Series Resistance (ESR): 70kΩ

## Nets
+3V3: C6.2 C7.1 C8.1 C34.2 C37.1 C55.1 CN3.3 H4.1 H7.1 H8.1 H9.1 R50.2 R52.2 R91.2 R116.2 R117.2 U16.28(VDD_2) U16.75(VDD_3) U16.100(VDD_1) U20.2(A1) U20.8(VCC) U23.4 U23.9 U25.5 U25.6
+5V: C27.1 C54.2 H4.3 H7.3 H8.3 H9.3 LED1.2(+) LED2.2(A) LED3.2(A) U23.11 U25.3 U25.4
GND: C1.1 C2.1 C5.1 C6.1 C7.2 C8.2 C9.2 C10.2 C12.2 C13.2 C15.2 C16.2 C18.2 C19.2 C27.2 C29.1 C30.1 C31.1 C34.1 C37.2 C39.2 C40.2 C42.2 C43.2 C45.2 C46.2 C48.2 C49.2 C50.1 C51.1 C52.2 C54.1 C55.2 C56.2 C58.1 C62.2 C63.2 C65.2 C66.2 C67.1 C68.1 C69.1 C70.1 CN3.5 CN3.7 CN4.1 CN5.1 CN6.1 CN7.1 D4.2(A) D5.2(A) D6.2(A) D7.2(A) D8.2(A) D9.2(A) D17.2(A) D35.2(A) D41.2(A) D42.2(A) D43.2(A) D46.2(A) D47.2(A) D48.2(A) D49.2(A) D50.2(A) D51.2(A) D52.2(A) H1.1 H1.2 H1.7 H1.8 H1.13 H1.14 H2.1 H2.2 H2.7 H2.8 H2.13 H2.14 H3.1 H3.2 H3.7 H3.8 H3.13 H3.14 Q3.2(S) Q6.2(S) Q7.2(S) Q8.2(S) Q9.2(S) R11.1 R55.2 R62.2 R66.2 R99.2 R101.2 SW2.3 SW2.4 U9.2 U16.20(VSSA/VREF-) U16.48(VREFSD-) U16.49(VSSSD) U16.74(VSS_3) U16.99(VSS_1) U17.2 U20.1(A0) U20.3(A2) U20.4(GND) U20.7(WP) U23.1 U23.3 U23.10 U23.12 U24.1 U24.6 U24.7 U24.12 U25.1 U25.2 U25.13 U25.16 U25.19 U25.20 U25.26 U25.29 U25.30
VBAT: C52.1 U16.6(VBAT) U23.7
VDDA: C62.1 C63.1 C65.1 C66.1 U16.21(VDDA) U16.22(VREF+) U16.50(VDDSD12) U16.51(VDDSD3) U23.5
ADIF_N_0: C4.2 C10.1 H1.6 U16.44(PE13)
ADIF_N_1: C11.2 C13.1 H1.12 U16.42(PE11)
ADIF_N_2: C14.2 C16.1 H1.5 U16.38(PE7)
ADIF_N_3: C17.2 C19.1 H1.11 U16.36(PB1)
ADIF_N_4: C44.2 C46.1 H2.6 U16.62(PD15)
ADIF_N_5: C47.2 C49.1 H2.12 U16.60(PD13)
ADIF_N_6: C38.2 C40.1 H2.5 U16.58(PD11)
ADIF_N_7: C41.2 C43.1 H2.11 U16.56(PD9)
ADIF_P_0: C4.1 C9.1 H1.4 U16.43(PE12)
ADIF_P_1: C11.1 C12.1 H1.10 U16.41(PE10)
ADIF_P_2: C14.1 C15.1 H1.3 U16.37(PB2)
ADIF_P_3: C17.1 C18.1 H1.9 U16.35(PB0)
ADIF_P_4: C44.1 C45.1 H2.4 U16.61(PD14)
ADIF_P_5: C47.1 C48.1 H2.10 U16.59(PD12)
ADIF_P_6: C38.1 C39.1 H2.3 U16.57(PD10)
ADIF_P_7: C41.1 C42.1 H2.9 U16.55(PD8)
BTN_FUNCTION_0: C29.2 R57.2 U16.63(PC6)
BTN_FUNCTION_1: C30.2 R92.2 U16.64(PC7)
CAN_RX: R133.2 U16.70(PA11)
CAN_TX: R132.2 U16.71(PA12)
DAC_OUT_0: C56.1 R134.2 U16.29(PA4)
GPIO_0: U16.5(PE6) U25.8
GPIO_1: U16.10(PF9) U25.10
GPIO_2: U16.11(PF10) U25.12
GPIO_3: U16.19(PF2) U25.14
I2C_SCL: D46.1(C) R112.2 R117.1 U20.6(SCL) U24.11
I2C_SDA: D47.1(C) R113.2 R116.1 U20.5(SDA) U24.10
MCU_1WIRE_0: R119.1 U16.1(PE2)
MCU_1WIRE_1: R121.1 U16.2(PE3)
MCU_1WIRE_2: R123.1 U16.3(PE4)
MCU_1WIRE_3: R125.1 U16.4(PE5)
MCU_DIG_IN_0: R9.1 U16.85(PD4)
MCU_DIG_IN_1: R84.1 U16.84(PD3)
MCU_DIG_IN_2: R85.1 U16.83(PD2)
MCU_DIG_IN_3: R86.1 U16.82(PD1)
MCU_DIG_IN_4: R87.1 U16.81(PD0)
MCU_DIG_IN_5: R88.1 U16.80(PC12)
MCU_DIG_IN_6: R89.1 U16.79(PC11)
MCU_DIG_IN_7: R90.1 U16.78(PC10)
MCU_I2C_SCL: R112.1 U16.68(PA9)
MCU_I2C_SDA: R113.1 U16.69(PA10)
MCU_SMB_ALERT: R83.1 U16.91(PB5)
MCU_SMB_CLK: R81.1 U16.77(PA15)
MCU_SMB_DATA: R82.1 U16.93(PB7)
MCU_STACK_ENABLE: R118.1 U16.67(PA8)
PWM_OUT_0: U16.65(PC8) U25.7
PWM_OUT_1: U16.66(PC9) U25.9
PWM_OUT_2: U16.26(PA3) U25.11
RESET: CN3.12 D9.1(C) R10.1 R50.1 SW2.1 SW2.2 TP18.1
SIG_LED_0: R98.2 U16.31(PA6)
SIG_LED_1: R102.2 U16.32(PA7)
SMB_ALERT: D42.1(C) R83.2 U24.4
SMB_CLK: D35.1(C) R81.2 U24.2
SMB_DATA: D41.1(C) R82.2 U24.3
SPI1_MISO: R129.1 U16.90(PB4)
SPI1_MOSI: R128.1 U16.73(PF6)
SPI1_SCK: R127.1 U16.30(PA5)
STACK_ENABLE: D48.1(C) H6.1 U24.9
STATUS_LED_BLU: R54.2 U16.25(PA2)
STATUS_LED_GRN: R60.1 U16.24(PA1)
STATUS_LED_RED: R65.1 U16.23(PA0)
STL_COM_RX: R26.1 U16.33(PC4 (USART1_TX))
STL_COM_TX: R28.1 U16.34(PC5 (USART1_RX))
SWCLK: R23.1 U16.76(PA14)
SWDIO: R22.1 U16.72(PA13)
TRACESWO: R27.1 U16.89(PB3)
USART2_RX: R130.1 U16.87(PD6)
USART2_TX: R131.1 U16.86(PD5)
VREF: C31.2 C58.2 U16.52(VREFSD+) U23.6
$1N2844: H3.3 R9.2
$1N2847: H3.5 R84.2
$1N2850: H3.9 R85.2
$1N2853: H3.11 R86.2
$1N3203: H3.4 R87.2
$1N3205: H3.10 R89.2
$1N3207: H3.12 R90.2
$1N3209: H3.6 R88.2
$1N5436: CN3.8 D7.1(C) R27.2 TP50.1
$1N5439: CN3.13 D4.1(C) R26.2 TP31.1
$1N5442: CN3.6 D6.1(C) R23.2 TP49.1
$1N5443: CN3.4 D5.1(C) R22.2 TP48.1
$1N5454: CN3.14 D8.1(C) R28.2 TP51.1
$1N6636: D17.1(C) R52.1 R57.1 TP17.1 U9.1
$1N6640: Q7.1(G) R65.2 R66.1
$1N6642: Q6.1(G) R60.2 R62.1
$1N6643: Q3.1(G) R54.1 R55.1
$1N6645: Q7.3(D) R47.1
$1N6646: Q6.3(D) R48.1
$1N6647: LED1.1(-) R49.2
$1N6648: LED1.4(-) R48.2
$1N6649: LED1.3(-) R47.2
$1N6650: Q3.3(D) R49.1
$1N9398: D43.1(C) R91.1 R92.1 TP52.1 U17.1
$1N10424: LED2.1(C) R97.2
$1N10441: Q8.1(G) R98.1 R99.1
$1N10471: Q8.3(D) R97.1
$1N10767: LED3.1(C) R100.2
$1N10769: Q9.1(G) R101.1 R102.1
$1N10779: Q9.3(D) R100.1
$1N12623: H6.2 R118.2
$1N24471: C50.2 U16.13(PF1-OSC_OUT) X3.1(OSC1)
$1N24472: C51.2 U16.12(PF0-OSC_IN) X3.2(OSC2)
$1N24475: C1.2 U16.8(PC14-OSC32_IN) X4.2
$1N24476: C2.2 U16.9(PC15-OSC32_OUT) X4.1
$1N24481: R11.2 U16.94(BOOT0)
$1N31636: C5.2 R10.2 U16.14(NRST)
$1N35506: CN4.3 D49.1(C) R119.2 R120.2 TP53.1
$1N35641: C67.2 CN4.2 H4.2 R120.1
$1N36416: CN5.3 D50.1(C) R121.2 R122.2 TP54.1
$1N36428: C68.2 CN5.2 H7.2 R122.1
$1N36724: CN6.3 D51.1(C) R123.2 R124.2 TP55.1
$1N36736: C69.2 CN6.2 H8.2 R124.1
$1N37032: CN7.3 D52.1(C) R125.2 R126.2 TP56.1
$1N37044: C70.2 CN7.2 H9.2 R126.1
$1N38247: R127.2 U25.21
$1N38279: R128.2 U25.23
$1N38311: R129.2 U25.25
$1N38371: R130.2 U25.17
$1N38403: R131.2 U25.15
$1N42906: R132.1 U25.24
$1N42951: R133.1 U25.22
$1N42978: R134.1 U25.18

Not connected (* = marked no-connect by the designer): CN3 1* 2* 9* 10* 11*; H1 15* 16*; H2 15* 16*; H3 15* 16*; U9 3* 4*; U16 7(PC13)* 15(PC0)* 16(PC1)* 17(PC2)* 18(PC3)* 27(PF4)* 39(PE8)* 40(PE9)* 45(PE14)* 46(PE15)* 47(PB10)* 53(PB14)* 54(PB15)* 88(PD7)* 92(PB6)* 95(PB8)* 96(PB9)* 97(PE0)* 98(PE1)*; U17 3* 4*; U23 2* 8*; U24 5* 8*; U25 27* 28*

## Notes on the sheet
- MCU
- Baseboard Connector
- SWD Header
- T_VCC
- SWDIO
- GND
- SWCLK
- GND
- SWO
- NRST
- VCP_RX
- VCP_TX
- Differential SDADC Inputs 0-3
- SMBUS
- FT-Pin
- FT-Pin
- FT-Pin
- FT-Pin
- Differential SDADC Inputs 4-7
- Generic Function Header
- 1 cap at each pin, X7R, 50V, 0603
- Digital Inputs
- I2C
- 1-Wire Headers
- Reset Button
- RGB Status LED
- Function Buttons
- Indicator LEDs
- 1W_1
- 1W_0
- RC close to MCU
- RC close to MCU
- EEPROM
- ADR 0x52
- 1W_2
- 1W_3
